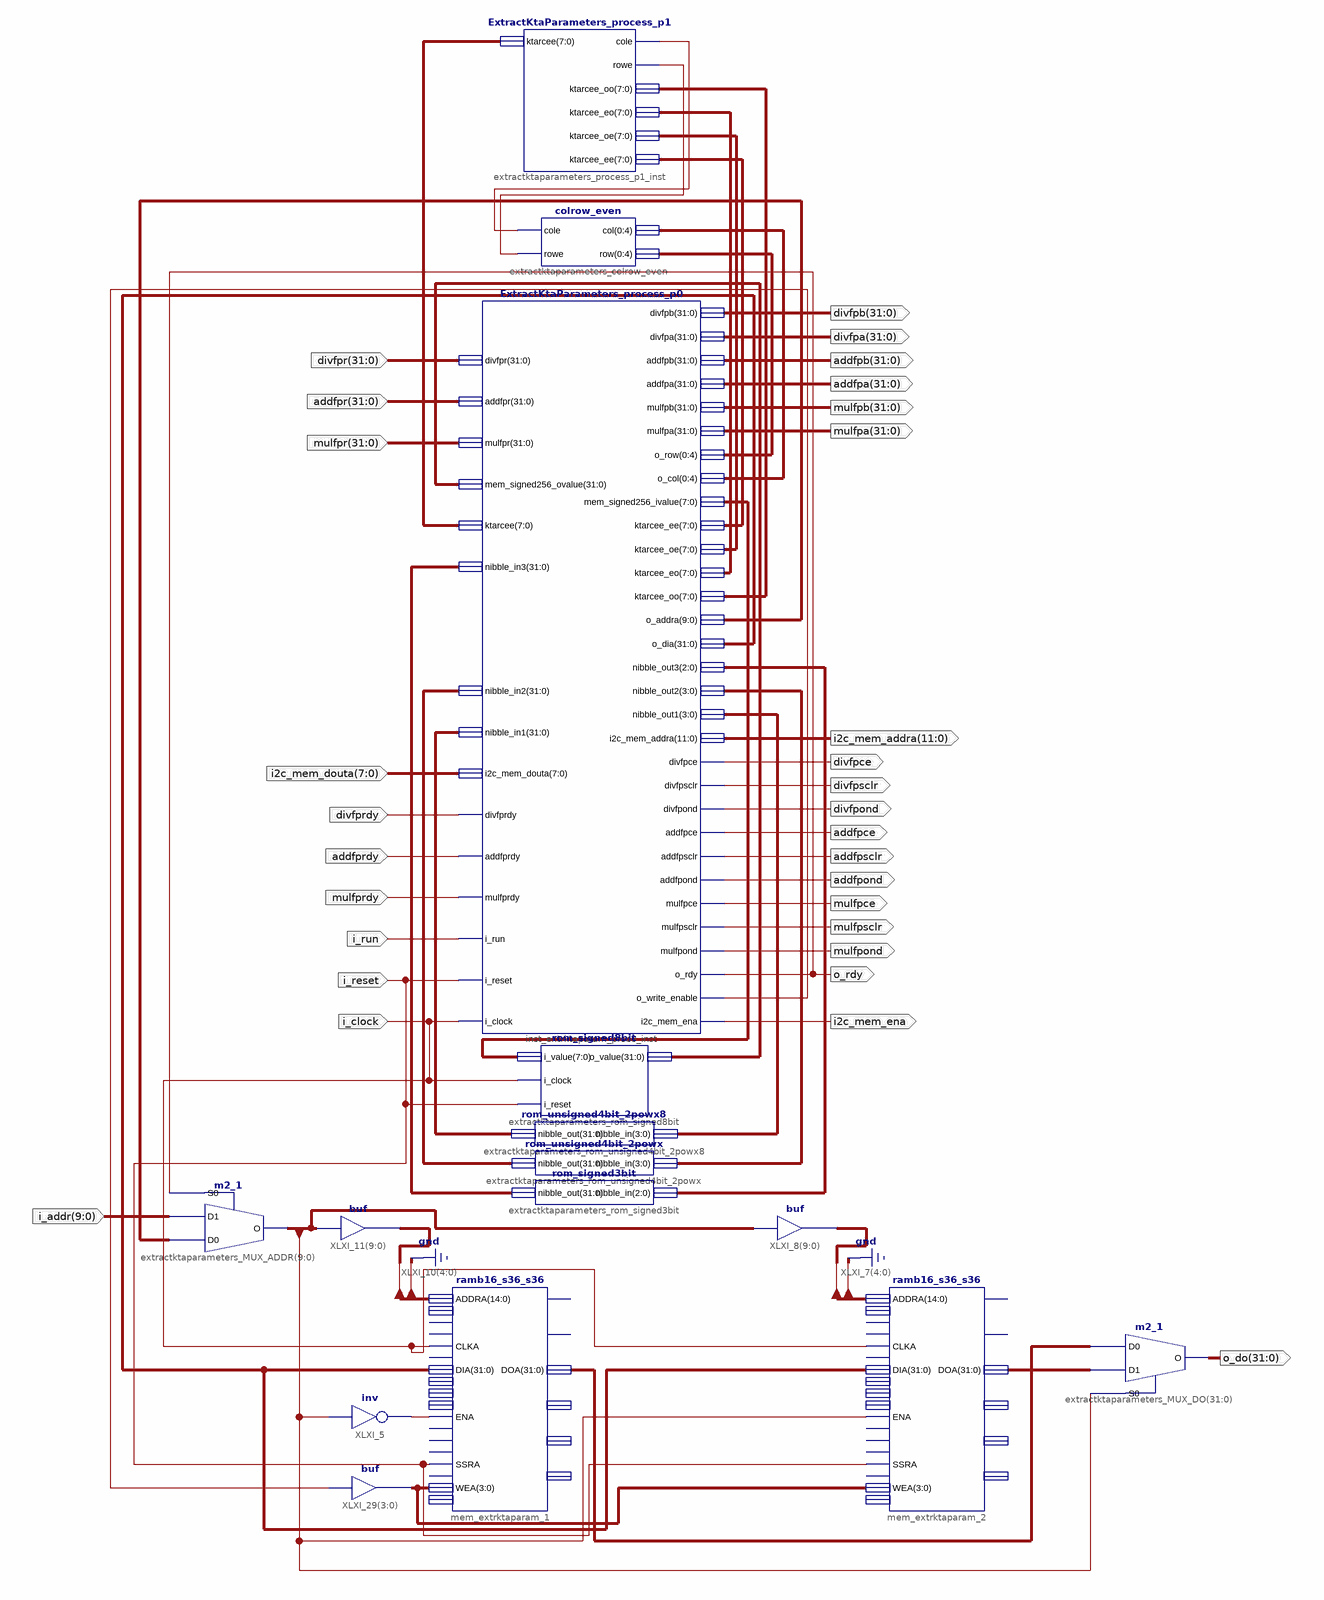
[diagram p0: schematic sheet 1]
// Xilinx ISE schematic ExtractKtaParameters.sch (virtex4) as structural Verilog: 15 symbols, 30 ports
module ExtractKtaParameters (
  input  [9:0] i_addr,
  input  i_clock,
  input  i_reset,
  input  [31:0] divfpr,
  input  [31:0] addfpr,
  input  [31:0] mulfpr,
  input  [7:0] i2c_mem_douta,
  input  divfprdy,
  input  addfprdy,
  input  mulfprdy,
  input  i_run,
  output o_rdy,
  output i2c_mem_ena,
  output mulfpond,
  output mulfpsclr,
  output mulfpce,
  output addfpond,
  output addfpsclr,
  output addfpce,
  output divfpond,
  output divfpsclr,
  output divfpce,
  output [11:0] i2c_mem_addra,
  output [31:0] mulfpa,
  output [31:0] mulfpb,
  output [31:0] addfpa,
  output [31:0] addfpb,
  output [31:0] divfpa,
  output [31:0] divfpb,
  output [31:0] o_do
);

  wire o_write_enable, XLXN_59, XLXN_243, XLXN_244;
  wire [2:0] XLXN_235;
  wire [3:0] XLXN_139, XLXN_197, XLXN_201;
  wire [4:0] XLXN_239, XLXN_240;
  wire [7:0] XLXN_196, XLXN_245, XLXN_246, XLXN_247, XLXN_248, XLXN_253;
  wire [9:0] mux_addr1, XLXN_254;
  wire [14:5] XLXN_44, XLXN_45;
  wire [31:0] XLXN_78, XLXN_79, XLXN_88, XLXN_173, XLXN_178, XLXN_200, XLXN_238;

  assign XLXN_45 = mux_addr1;  // buf XLXI_8[9..0], 10 bits wide
  assign XLXN_44 = mux_addr1;  // buf XLXI_11[9..0], 10 bits wide
  not XLXI_5 (XLXN_59, mux_addr1[9]);
  ramb16_s36_s36 #(.WRITE_WIDTH_B(36), .WRITE_WIDTH_A(36), .WRITE_MODE_B("READ_FIRST"), .WRITE_MODE_A("READ_FIRST"), .READ_WIDTH_B(36), .READ_WIDTH_A(36)) mem_extrktaparam_1 (
    .ADDRA({XLXN_44, {5{1'b0}}}), .CLKA(i_clock), .DIA(XLXN_88), .ENA(XLXN_59), .SSRA(i_reset),
    .WEA(XLXN_139), .DOA(XLXN_79));  // open: ADDRB, CASCADEINA, CASCADEINB, CLKB, DIB, DIPA, DIPB, REGCEA, REGCEB, ENB, SSRB, WEB, CASCADEOUTA, CASCADEOUTB, DOB, DOPA, DOPB
  m2_1 extractktaparameters_MUX_DO[31:0] (.D0(XLXN_79), .D1(XLXN_78), .S0(mux_addr1[9]), .O(o_do));
  assign XLXN_139 = {4{o_write_enable}};  // buf XLXI_29[3..0], 4 bits wide
  m2_1 extractktaparameters_MUX_ADDR[9:0] (.D0(XLXN_254), .D1(i_addr), .S0(o_rdy), .O(mux_addr1));
  ramb16_s36_s36 #(.WRITE_WIDTH_B(36), .WRITE_WIDTH_A(36), .WRITE_MODE_B("READ_FIRST"), .WRITE_MODE_A("READ_FIRST"), .READ_WIDTH_B(36), .READ_WIDTH_A(36)) mem_extrktaparam_2 (
    .ADDRA({XLXN_45, {5{1'b0}}}), .CLKA(i_clock), .DIA(XLXN_88), .ENA(mux_addr1[9]), .SSRA(i_reset),
    .WEA(XLXN_139), .DOA(XLXN_78));  // open: ADDRB, CASCADEINA, CASCADEINB, CLKB, DIB, DIPA, DIPB, REGCEA, REGCEB, ENB, SSRB, WEB, CASCADEOUTA, CASCADEOUTB, DOB, DOPA, DOPB
  ExtractKtaParameters_process_p0 inst_extrktaparam_proc0_inst (
    .i_clock(i_clock), .i_reset(i_reset), .i_run(i_run), .mulfprdy(mulfprdy), .addfprdy(addfprdy),
    .divfprdy(divfprdy), .i2c_mem_douta(i2c_mem_douta), .nibble_in1(XLXN_178), .nibble_in2(XLXN_200),
    .nibble_in3(XLXN_238), .ktarcee(XLXN_253), .mem_signed256_ovalue(XLXN_173), .mulfpr(mulfpr),
    .addfpr(addfpr), .divfpr(divfpr), .i2c_mem_ena(i2c_mem_ena), .o_write_enable(o_write_enable),
    .o_rdy(o_rdy), .mulfpond(mulfpond), .mulfpsclr(mulfpsclr), .mulfpce(mulfpce), .addfpond(addfpond),
    .addfpsclr(addfpsclr), .addfpce(addfpce), .divfpond(divfpond), .divfpsclr(divfpsclr), .divfpce(divfpce),
    .i2c_mem_addra(i2c_mem_addra), .nibble_out1(XLXN_201), .nibble_out2(XLXN_197), .nibble_out3(XLXN_235),
    .o_dia(XLXN_88), .o_addra(XLXN_254), .ktarcee_oo(XLXN_248), .ktarcee_eo(XLXN_247), .ktarcee_oe(XLXN_246),
    .ktarcee_ee(XLXN_245), .mem_signed256_ivalue(XLXN_196),
    .o_col({XLXN_240[0], XLXN_240[1], XLXN_240[2], XLXN_240[3], XLXN_240[4]}),
    .o_row({XLXN_239[0], XLXN_239[1], XLXN_239[2], XLXN_239[3], XLXN_239[4]}), .mulfpa(mulfpa),
    .mulfpb(mulfpb), .addfpa(addfpa), .addfpb(addfpb), .divfpa(divfpa), .divfpb(divfpb));
  rom_signed8bit extractktaparameters_rom_signed8bit (
    .i_value(XLXN_196), .i_clock(i_clock), .i_reset(i_reset), .o_value(XLXN_173));
  rom_unsigned4bit_2powx8 extractktaparameters_rom_unsigned4bit_2powx8 (.nibble_in(XLXN_201), .nibble_out(XLXN_178));
  rom_unsigned4bit_2powx extractktaparameters_rom_unsigned4bit_2powx (.nibble_in(XLXN_197), .nibble_out(XLXN_200));
  rom_signed3bit extractktaparameters_rom_signed3bit (.nibble_in(XLXN_235), .nibble_out(XLXN_238));
  colrow_even extractktaparameters_colrow_even (
    .col({XLXN_240[0], XLXN_240[1], XLXN_240[2], XLXN_240[3], XLXN_240[4]}),
    .row({XLXN_239[0], XLXN_239[1], XLXN_239[2], XLXN_239[3], XLXN_239[4]}), .cole(XLXN_243), .rowe(XLXN_244));
  ExtractKtaParameters_process_p1 extractktaparameters_process_p1_inst (
    .cole(XLXN_243), .rowe(XLXN_244), .ktarcee_oo(XLXN_248), .ktarcee_eo(XLXN_247), .ktarcee_oe(XLXN_246),
    .ktarcee_ee(XLXN_245), .ktarcee(XLXN_253));
endmodule
